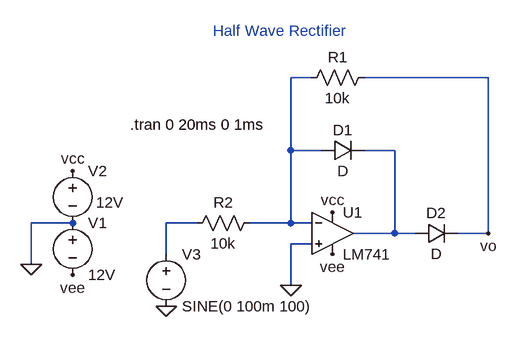
[diagram p0: schematic half_wave.asc]
half_wave.asc, the LTspice schematic file:
Version 4.1
SHEET 1 880 680
WIRE 368 -32 336 -32
WIRE 640 -32 448 -32
WIRE 336 80 336 -32
WIRE 384 80 336 80
WIRE 496 80 448 80
WIRE 0 192 -64 192
WIRE 192 192 144 192
WIRE 336 192 336 80
WIRE 336 192 272 192
WIRE 368 192 336 192
WIRE 496 208 496 80
WIRE 496 208 432 208
WIRE 528 208 496 208
WIRE 640 208 640 -32
WIRE 640 208 592 208
WIRE 368 224 336 224
WIRE 144 240 144 192
WIRE -64 256 -64 192
WIRE 336 288 336 224
FLAG -64 256 0
FLAG 0 272 vee
FLAG 0 112 vcc
FLAG 400 176 vcc
FLAG 400 240 vee
FLAG 336 288 0
FLAG 144 320 0
FLAG 640 208 vo
SYMBOL voltage 0 176 R0
WINDOW 123 0 0 Left 0
WINDOW 39 0 0 Left 0
SYMATTR InstName V1
SYMATTR Value 12V
SYMBOL voltage 0 96 R0
WINDOW 123 0 0 Left 0
WINDOW 39 0 0 Left 0
WINDOW 3 36 64 Left 2
SYMATTR InstName V2
SYMATTR Value 12V
SYMBOL LM741 400 144 R0
SYMATTR InstName U1
SYMBOL diode 384 64 M90
WINDOW 0 0 32 VBottom 2
WINDOW 3 32 32 VTop 2
SYMATTR InstName D1
SYMBOL diode 528 192 M90
WINDOW 0 0 32 VBottom 2
WINDOW 3 32 32 VTop 2
SYMATTR InstName D2
SYMBOL res 464 -48 R90
WINDOW 0 0 56 VBottom 2
WINDOW 3 32 56 VTop 2
SYMATTR InstName R1
SYMATTR Value 10k
SYMBOL res 288 176 R90
WINDOW 0 0 56 VBottom 2
WINDOW 3 32 56 VTop 2
SYMATTR InstName R2
SYMATTR Value 10k
SYMBOL voltage 144 224 R0
WINDOW 123 0 0 Left 0
WINDOW 39 0 0 Left 0
SYMATTR InstName V3
SYMATTR Value SINE(0 100m 100)
TEXT 216 -104 Left 2 ;Half Wave Rectifier
TEXT 88 40 Left 2 !.tran 0 20ms 0 1ms

The netlist it stands for:
* half_wave.asc
V1 0 vee 12V
V2 vcc 0 12V
X§U1 0 N001 vcc vee N002 LM741  ; pins In+ In- V+ V- OUT
D1 N001 N002 D
D2 N002 vo D
R1 vo N001 10k
R2 N001 N003 10k
V3 N003 0 SINE(0 100m 100)
.model D D
.lib standard.dio
* Half Wave Rectifier
.tran 0 20ms 0 1ms
.lib LM741.lib
.backanno
.end